# EAGLE schematic cem3396_v4.0 (EAGLE 7.6.0)
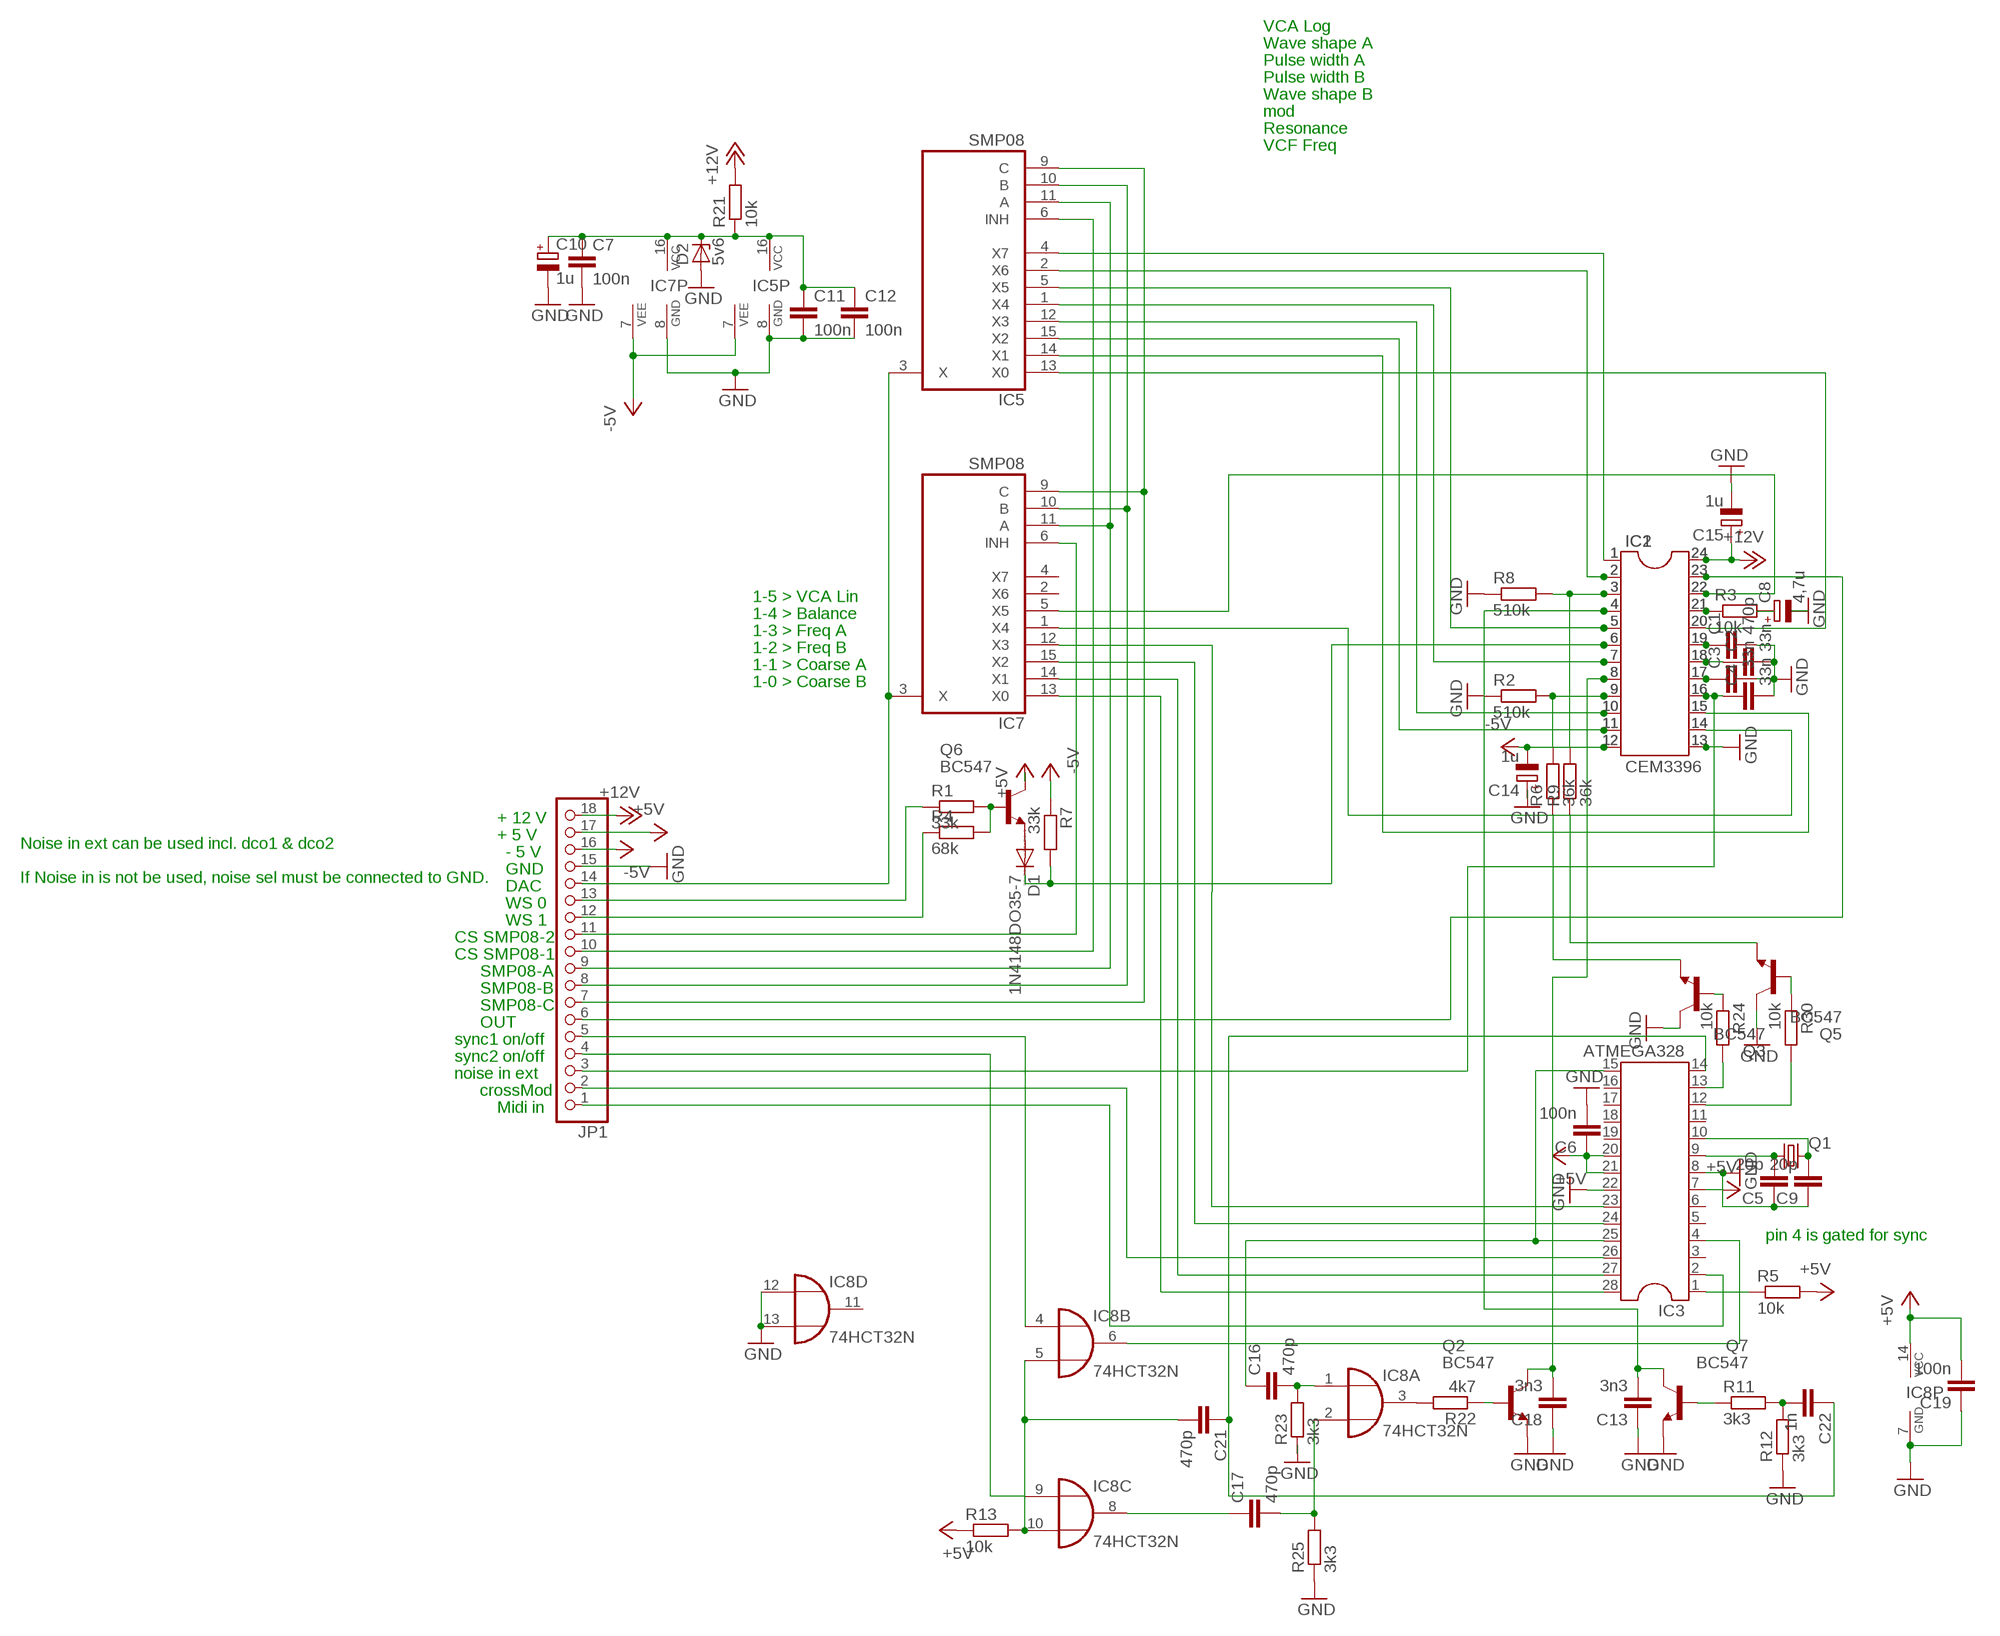
[diagram p0: schematic, sheet 1]

## Parts
C1  470p  C-EU050-024X044  [C050-024X044]
C2  33n  C-EU050-024X044  [C050-024X044]
C3  33n  C-EU050-024X044  [C050-024X044]
C4  33n  C-EU050-024X044  [C050-024X044]
C5  20p  C-EU050-024X044  [C050-024X044]
C6  100n  C-EU050-024X044  [C050-024X044]
C7  100n  C-EU050-024X044  [C050-024X044]
C8  4,7u  CPOL-EUE2-4  [E2-4]
C9  20p  C-EU050-024X044  [C050-024X044]
C10  1u  CPOL-EUE2-4  [E2-4]
C11  100n  C-EU050-024X044  [C050-024X044]
C12  100n  C-EU050-024X044  [C050-024X044]
C13  3n3  C-EU050-024X044  [C050-024X044]
C14  1u  CPOL-EUE2-4  [E2-4]
C15  1u  CPOL-EUE2-4  [E2-4]
C16  470p  C-EU050-024X044  [C050-024X044]
C17  470p  C-EU050-024X044  [C050-024X044]
C18  3n3  C-EU050-024X044  [C050-024X044]
C19  100n  C-EU050-024X044  [C050-024X044]
C21  470p  C-EU050-024X044  [C050-024X044]
C22  1n  C-EU050-024X044  [C050-024X044]
D1  1N4148DO35-7  [DO35-7]
D2  5v6  ZENER-DIODEZD-7.5  [ZDIO-7.5]
IC1  DIL24-3  [DIL24-3]
IC2  CEM3396  DIL24-6  [DIL24-6]
IC3  ATMEGA328  DIL28-3  [DIL28-3]
IC5  SMP08  4051D  [SO16]
IC7  SMP08  4051D  [SO16]
IC8  74HCT32N  [DIL14]
JP1  PINHD-1X18  [1X18]
Q1  CRYSTALHC49S  [HC49/S]
Q2  BC547  [TO92]
Q3  BC547  [TO92]
Q5  BC547  [TO92]
Q6  BC547  [TO92]
Q7  BC547  [TO92]
R1  33k  R-EU_0204/7  [0204/7]
R2  510k  R-EU_0204/7  [0204/7]
R3  10k  R-EU_0204/7  [0204/7]
R4  68k  R-EU_0204/7  [0204/7]
R5  10k  R-EU_0204/7  [0204/7]
R6  36k  R-EU_0204/7  [0204/7]
R7  33k  R-EU_0204/7  [0204/7]
R8  510k  R-EU_0204/7  [0204/7]
R9  36k  R-EU_0204/7  [0204/7]
R11  3k3  R-EU_0204/7  [0204/7]
R12  3k3  R-EU_0204/7  [0204/7]
R13  10k  R-EU_0204/7  [0204/7]
R21  10k  R-EU_0204/7  [0204/7]
R22  4k7  R-EU_0204/7  [0204/7]
R23  3k3  R-EU_0204/7  [0204/7]
R24  10k  R-EU_0204/7  [0204/7]
R25  3k3  R-EU_0204/7  [0204/7]
R30  10k  R-EU_0204/7  [0204/7]

## Nets
+5V: C6.1 C19.2 IC3.7 IC3.20 IC3.21 IC8.14(P:VCC) JP1.17 Q6.3(C) R5.2 R13.1
+12V: C15.+ IC1.24 IC2.24 JP1.18 R21.2
-5V: C14.- IC1.12 IC2.12 IC5.7(VEE) IC7.7(VEE) JP1.16 R7.1
GND: C1.2 C2.2 C3.2 C4.2 C5.1 C6.2 C7.2 C8.- C9.1 C10.- C11.2 C12.2 C13.1 C14.+ C15.- C18.1 C19.1 D2.A IC1.13 IC2.13 IC3.8 IC3.22 IC5.8(GND) IC7.8(GND) IC8.7(P:GND) IC8.12(D:I0) IC8.13(D:I1) JP1.15 Q2.1(E) Q3.3(C) Q5.3(C) Q7.1(E) R2.1 R8.1 R12.1 R23.1 R25.1
N$1: IC1.1 IC2.1 IC5.4(X7)
N$2: IC3.4 IC8.6(B:O)
N$3: IC1.10 IC2.10 IC5.12(X3)
N$4: IC3.13 R24.2
N$5: IC1.14 IC2.14 IC7.1(X4)
N$6: D1.A Q6.1(E)
N$7: IC8.9(C:I0) JP1.4
N$8: C8.+ R3.2
N$9: C21.1 C22.1 IC3.14
N$10: IC5.6(INH) JP1.10
N$11: IC7.12(X3)
N$12: C4.1 IC1.16 IC2.16 JP1.3
N$13: IC3.26 JP1.2
N$14: Q3.1(E) R6.1
N$15: IC1.15 IC2.15 IC5.14(X1)
N$17: C3.1 IC1.17 IC2.17
N$18: C2.1 IC1.18 IC2.18
N$19: C1.1 IC1.19 IC2.19
N$21: IC1.21 IC2.21 R3.1
N$22: IC3.1 R5.1
N$23: IC1.23 IC2.23 JP1.6
N$25: IC3.12 R30.2
N$26: IC1.22 IC2.22 IC7.5(X5)
N$28: IC3.2 JP1.1
N$29: C7.1 C10.+ C11.1 C12.1 D2.C IC5.16(VCC) IC7.16(VCC) R21.1
N$30: C9.2 IC3.10 Q1.2
N$31: C5.2 IC3.9 Q1.1
N$32: IC8.4(B:I0) JP1.5
N$33: Q5.1(E) R9.1
N$34: Q6.2(B) R1.2 R4.2
N$35: IC1.2 IC2.2 IC5.2(X6)
N$36: IC1.5 IC2.5 IC5.5(X5)
N$37: IC1.11 IC2.11 IC5.15(X2)
N$38: IC1.7 IC2.7 IC5.1(X4)
N$39: IC1.3 IC2.3 R8.2 R9.2
N$40: IC1.20 IC2.20 IC5.13(X0)
N$41: IC1.9 IC2.9 R2.2 R6.2
N$42: IC3.27 IC7.14(X1)
N$43: IC3.28 IC7.13(X0)
N$44: D1.C IC1.6 IC2.6 R7.2
N$45: IC5.10(B) IC7.10(B) JP1.8
N$46: JP1.13 R1.1
N$47: IC5.9(C) IC7.9(C) JP1.7
N$48: JP1.12 R4.1
N$49: IC3.24 IC7.15(X2)
N$50: IC7.6(INH) JP1.11
N$51: IC5.3(X) IC7.3(X) JP1.14
N$53: C13.2 IC1.4 IC2.4 Q7.3(C)
N$54: Q7.2(B) R11.1
N$55: C22.2 R11.2 R12.2
N$56: IC5.11(A) IC7.11(A) JP1.9
N$65: IC3.23
N$67: IC8.3(A:O) R22.2
N$71: Q5.2(B) R30.1
N$73: C16.2 IC8.1(A:I0) R23.2
N$74: C17.1 IC8.8(C:O)
N$75: C17.2 IC8.2(A:I1) R25.2
N$76: Q3.2(B) R24.1
N$78: C18.2 IC1.8 IC2.8 Q2.3(C)
N$79: Q2.2(B) R22.1
N$85: C21.2 IC8.5(B:I1) IC8.10(C:I1) R13.2
N$86: C16.1 IC3.15 IC3.25
Unconnected: IC3.3 IC3.5 IC3.6 IC3.11 IC3.16 IC3.17 IC3.18 IC3.19 IC7.2(X6) IC7.4(X7) IC8.11(D:O)

## Notes on the sheet
- VCA Log
- Wave shape A
- Pulse width A
- Pulse width B
- Wave shape B
- mod
- Resonance
- VCF Freq
- 1-5 > VCA Lin
- 1-4 > Balance
- 1-3 > Freq A
- 1-2 > Freq B
- 1-1 > Coarse A
- 1-0 > Coarse B
- + 12 V
- + 5 V
- Noise in ext can be used incl. dco1 & dco2
- - 5 V
- GND
- If Noise in is not be used, noise sel must be connected to GND.
- DAC
- WS 0
- WS 1
- CS SMP08-2
- CS SMP08-1
- SMP08-A
- SMP08-B
- SMP08-C
- OUT
- sync1 on/off
- sync2 on/off
- noise in ext
- crossMod
- Midi in
- pin 4 is gated for sync

## Library data of the parts
C1-C7 C9 C11-C13 C16-C19 C21 C22 = rcl:C-EU: CAPACITOR, European symbol
C8 C10 C14 C15 = rcl:CPOL-EU: POLARIZED CAPACITOR, European symbol
D1 = diode:1N4148: DIODE high speed (Philips)
D2 = diode:ZENER-DIODE: Z-Diode
IC1 IC2 = ic-package:DIL24: Dual In Line
IC3 = ic-package:DIL28: Dual In Line
IC5 IC7 = 40xx:4051: 8-channel ANALOG MULTIPLEXER
IC8 = 74xx-eu:74*32: Quad 2-input OR gate
JP1 = pinhead:PINHD-1X18: PIN HEADER
Q1 = crystal:CRYSTAL: CRYSTAL; OC_FARNELL: 1667008; OC_NEWARK: unknown
Q2 Q3 Q5-Q7 = transistor-npn:BC547*: NPN Transistor
R1-R9 R11-R13 R21-R25 R30 = rcl:R-EU_: RESISTOR, European symbol